# Altium project power_board_Project.PrjPCB
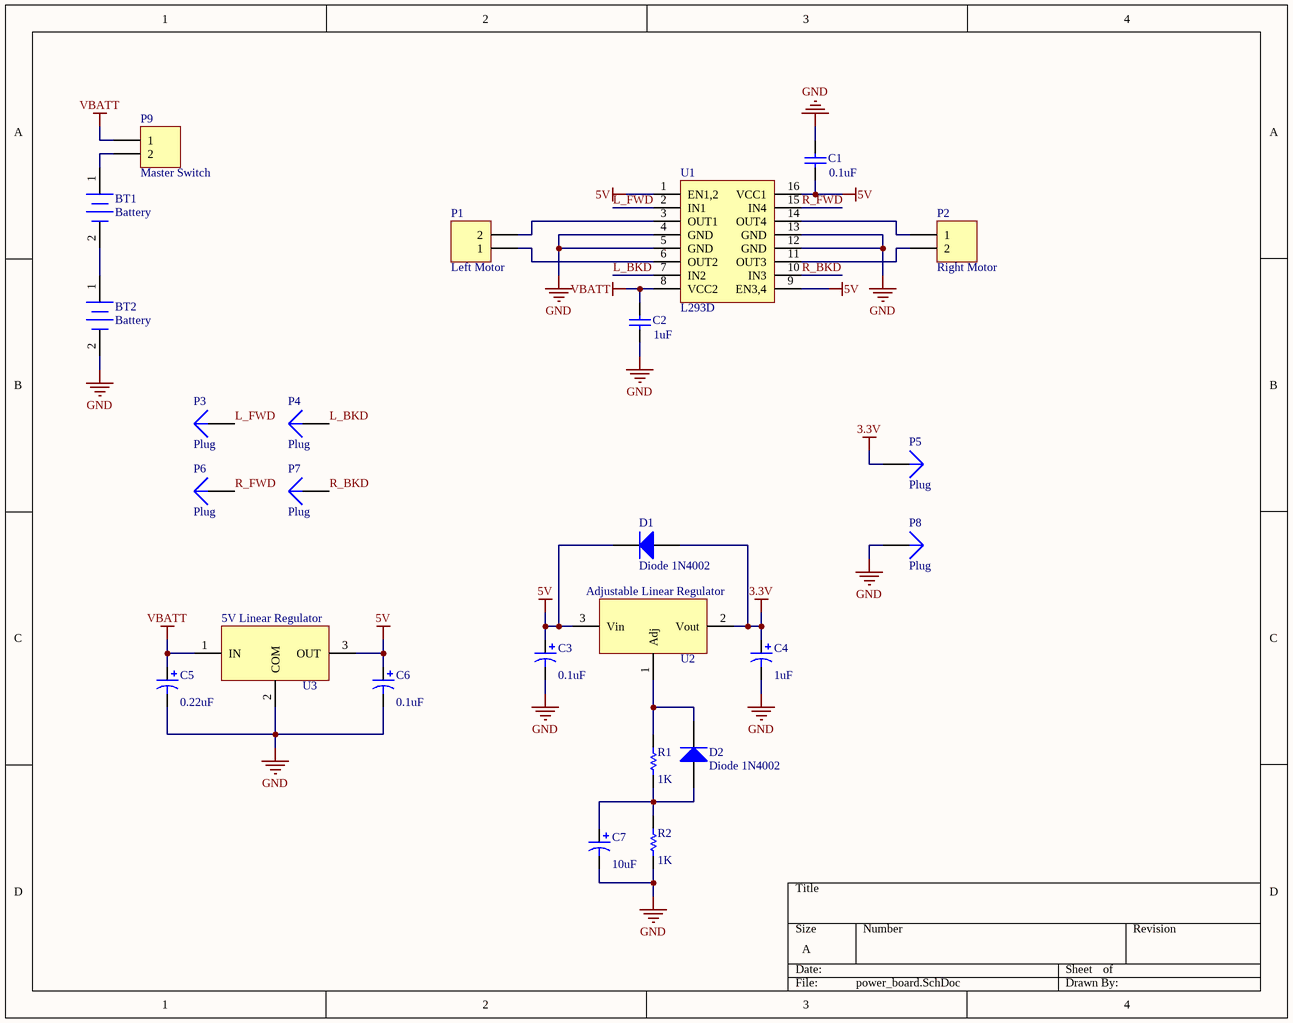
[diagram p0: power_board.SchDoc]
1 sheet, 25 parts. Net scope: global (net labels, ports and power ports of the same name join across sheets).
Board file: power_board.PcbDoc

## Sheet power_board.SchDoc
size A

### Parts
BT1  Battery  [VBATT]
BT2  Battery  [VBATT]
C1  value 0.1uF  [AXIAL-0.3]  (hidden comment: Cap)
C2  value 1uF  [AXIAL-0.3]  (hidden comment: Cap)
C3  value 0.1uF  [AXIAL-0.3]  (hidden comment: Cap Pol3)
C4  value 1uF  [AXIAL-0.3]  (hidden comment: Cap Pol3)
C5  value 0.22uF  [AXIAL-0.3]  (hidden comment: Cap Pol3)
C6  value 0.1uF  [AXIAL-0.3]  (hidden comment: Cap Pol3)
C7  value 10uF  [AXIAL-0.3]  (hidden comment: Cap Pol3)
D1  Diode 1N4002  [DO-41]
D2  Diode 1N4002  [DO-41]
P1  Left Motor  [Screw Terminal]
P2  Right Motor  [Screw Terminal]
P3  Plug  [STANDOFF]
P4  Plug  [STANDOFF]
P5  Plug  [STANDOFF]
P6  Plug  [STANDOFF]
P7  Plug  [STANDOFF]
P8  Plug  [STANDOFF]
P9  Master Switch  [Screw Terminal]
R1  value 1K  [AXIAL-0.3]  (hidden comment: Res1)
R2  value 1K  [AXIAL-0.3]  (hidden comment: Res1)
U1  L293D  [DIP-16]
U2  Adjustable Linear Regulator  [TO-220AB]
U3  5V Linear Regulator  [TO-220AB]

### Nets
3.3V: C4.1 D1.1(A) P5.1 U2.2(Vout)
5V: C1.1 C3.1 C6.1 D1.2(K) U1.1(EN1,2) U1.9(EN3,4) U1.16(VCC1) U2.3(Vin) U3.3(OUT)
GND: BT2.2(-) C1.2 C2.1 C3.2 C4.2 C5.2 C6.2 C7.2 P8.1 R2.1 U1.4(GND) U1.5(GND) U1.12(GND) U1.13(GND) U3.2(COM)
VBATT: C2.2 C5.1 P9.1 U1.8(VCC2) U3.1(IN)
L_BKD: P4.1 U1.7(IN2)
L_FWD: P3.1 U1.2(IN1)
R_BKD: P7.1 U1.10(IN3)
R_FWD: P6.1 U1.15(IN4)
NetBT1_1: BT1.1(+) P9.2
NetBT1_2: BT1.2(-) BT2.1(+)
NetC7_1: C7.1 D2.1(A) R1.1 R2.2
NetD2_2: D2.2(K) R1.2 U2.1(Adj)
NetP1_1: P1.1 U1.6(OUT2)
NetP1_2: P1.2 U1.3(OUT1)
NetP2_1: P2.1 U1.14(OUT4)
NetP2_2: P2.2 U1.11(OUT3)

### Library data of the parts
BT1 BT2 = Battery: Multicell Battery; pin to pad: 1>2 2>1; Published: 24-Mar-1999; LatestRevisionDate: 17-Jul-2002; LatestRevisionNote: Re-released for DXP Platform.; PackageReference: BAT-2; Publisher: Altium Limited; PackageDescription: Battery; 2 Leads
C1 C2 = Cap: Capacitor; Published: 8-Jun-2000; LatestRevisionDate: 17-Jul-2002; LatestRevisionNote: Re-released for DXP Platform.; PackageReference: RAD-0.3; Publisher: Altium Limited; PackageDescription: Radial Cap, Thru-Hole; 2 Leads; 0.3 in Pin Spacing
C3-C7 = Cap Pol3: Polarized Capacitor (Surface Mount); Published: 8-Jun-2000; LatestRevisionDate: 29-May-2009; LatestRevisionNote: IPC-7351 Footprint Added.; PackageReference: C0805; Publisher: Altium Limited; PackageDescription: Chip Capacitor
D1 D2 = Diode 1N4002: 1 Amp General Purpose Rectifier; Published: 8-Jun-2000; LatestRevisionDate: 17-Jul-2002; LatestRevisionNote: Re-released for DXP Platform.; DatasheetVersion: 1998; PackageVersion: Aug-1999; PackageReference: DO-41; Publisher: Altium Limited; PackageDescription: Diode, Axial; Body 5.2 x 2.7 mm (LxDia. max), Lead Dia. 0.86 mm (max); Code_JEDEC: DO-204-AL; ComponentLink1Description: Manufacturer Link; ComponentLink1URL: http://www.fairchildsemi.com/; ComponentLink2Description: Datasheet; ComponentLink2URL: http://www.fairchildsemi.com/ds/1N%2F1N4001.pdf
P1 P2 P9 = Header 2: Header, 2-Pin; LatestRevisionDate: 17-Jul-2002; LatestRevisionNote: Re-released for DXP Platform.; Publisher: Altium Limited
R1 R2 = Res1: Resistor; Published: 8-Jun-2000; LatestRevisionDate: 17-Jul-2002; LatestRevisionNote: Re-released for DXP Platform.; PackageReference: AXIAL-0.3; Publisher: Altium Limited; PackageDescription: Axial Device, Thru-Hole; 2 Leads; 0.3 in Pin Spacing
U2 = LM317T
U3 = LM7805C
P3-P8 = Plug: LatestRevisionDate: 17-Jul-2002; LatestRevisionNote: Re-released for DXP Platform.; Publisher: Altium Limited